# EAGLE design isofet (EAGLE 4.13)
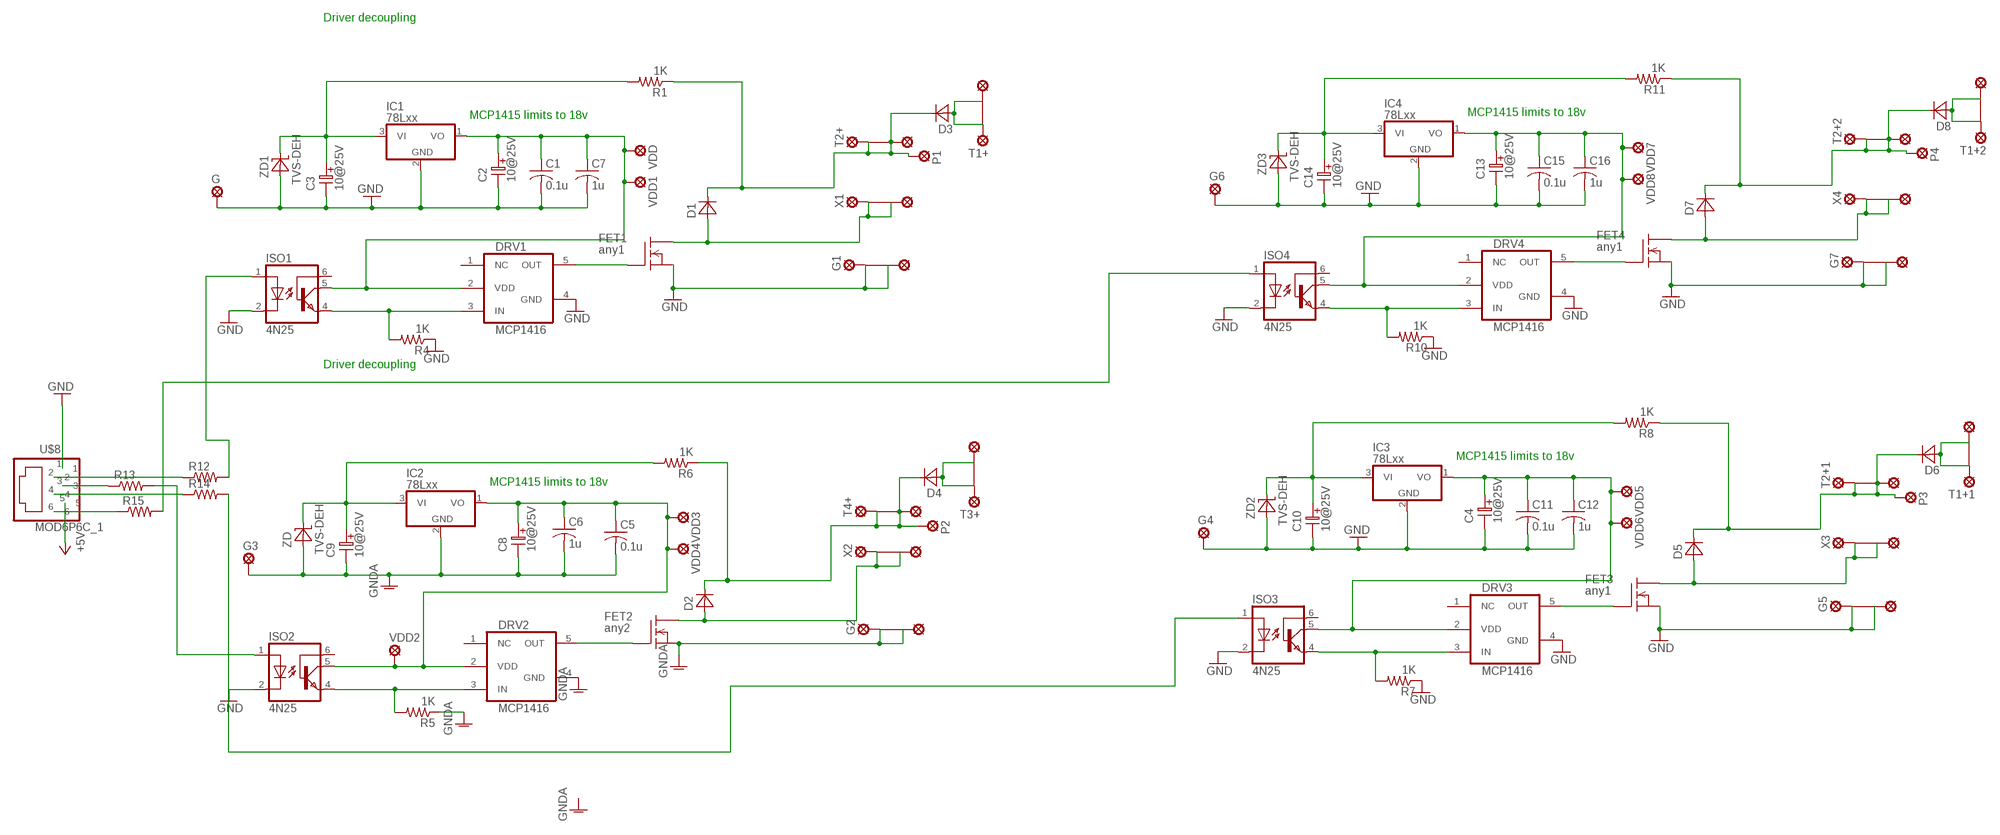
[diagram p0: schematic, sheet 1]

## Parts
C1  0.1u  C-USC0603  [C0603]
C2  10@25V  ELC-2,5L  [ES-2,5L]
C3  10@25V  ELC-2,5L  [ES-2,5L]
C4  10@25V  ELC-2,5L  [ES-2,5L]
C5  0.1u  C-USC0603  [C0603]
C6  1u  C-USC0603  [C0603]
C7  1u  C-USC0603  [C0603]
C8  10@25V  ELC-2,5L  [ES-2,5L]
C9  10@25V  ELC-2,5L  [ES-2,5L]
C10  10@25V  ELC-2,5L  [ES-2,5L]
C11  0.1u  C-USC0603  [C0603]
C12  1u  C-USC0603  [C0603]
C13  10@25V  ELC-2,5L  [ES-2,5L]
C14  10@25V  ELC-2,5L  [ES-2,5L]
C15  0.1u  C-USC0603  [C0603]
C16  1u  C-USC0603  [C0603]
D1  DIODE-10  [D-10]
D2  DIODE-10  [D-10]
D3  DIODE-10  [D-10]
D4  DIODE-10  [D-10]
D5  DIODE-10  [D-10]
D6  DIODE-10  [D-10]
D7  DIODE-10  [D-10]
D8  DIODE-10  [D-10]
DRV1  MCP1416  [SOT23-5]
DRV2  MCP1416  [SOT23-5]
DRV3  MCP1416  [SOT23-5]
DRV4  MCP1416  [SOT23-5]
FET1  any1  FET220V  [TO220V]
FET2  any2  FET220V  [TO220V]
FET3  any1  FET220V  [TO220V]
FET4  any1  FET220V  [TO220V]
G  SOLDPAD028  [SOLPAD028]
G1  SOLPADQUICKDISC  [SOLPADQUICKDISC]
G2  SOLPADQUICKDISC  [SOLPADQUICKDISC]
G3  SOLDPAD028  [SOLPAD028]
G4  SOLDPAD028  [SOLPAD028]
G5  SOLPADQUICKDISC  [SOLPADQUICKDISC]
G6  SOLDPAD028  [SOLPAD028]
G7  SOLPADQUICKDISC  [SOLPADQUICKDISC]
IC1  78Lxx  7805L  [TO92]
IC2  78Lxx  7805L  [TO92]
IC3  78Lxx  7805L  [TO92]
IC4  78Lxx  7805L  [TO92]
ISO1  4N25  4N35  [DIL06]
ISO2  4N25  4N35  [DIL06]
ISO3  4N25  4N35  [DIL06]
ISO4  4N25  4N35  [DIL06]
P1  SOLPAD035  [SOLDPAD035]
P2  SOLPAD035  [SOLDPAD035]
P3  SOLPAD035  [SOLDPAD035]
P4  SOLPAD035  [SOLDPAD035]
R1  1K  R-US_R0603  [R0603]
R4  1K  R-US_R0603  [R0603]
R5  1K  R-US_R0603  [R0603]
R6  1K  R-US_R0603  [R0603]
R7  1K  R-US_R0603  [R0603]
R8  1K  R-US_R0603  [R0603]
R10  1K  R-US_R0603  [R0603]
R11  1K  R-US_R0603  [R0603]
R12  R-US_0207/2V  [0207/2V]
R13  R-US_0207/2V  [0207/2V]
R14  R-US_0207/2V  [0207/2V]
R15  R-US_0207/2V  [0207/2V]
T1+  SOLPADQUICKDISC  [SOLPADQUICKDISC]
T1+1  SOLPADQUICKDISC  [SOLPADQUICKDISC]
T1+2  SOLPADQUICKDISC  [SOLPADQUICKDISC]
T2+  SOLPADQUICKDISC  [SOLPADQUICKDISC]
T2+1  SOLPADQUICKDISC  [SOLPADQUICKDISC]
T2+2  SOLPADQUICKDISC  [SOLPADQUICKDISC]
T3+  SOLPADQUICKDISC  [SOLPADQUICKDISC]
T4+  SOLPADQUICKDISC  [SOLPADQUICKDISC]
U$8  MOD6P6C_1  [MOD6P6C_1]
VDD  SOLDPAD028  [SOLPAD028]
VDD1  SOLPAD035  [SOLDPAD035]
VDD2  SOLPAD035  [SOLDPAD035]
VDD3  SOLDPAD028  [SOLPAD028]
VDD4  SOLPAD035  [SOLDPAD035]
VDD5  SOLDPAD028  [SOLPAD028]
VDD6  SOLPAD035  [SOLDPAD035]
VDD7  SOLDPAD028  [SOLPAD028]
VDD8  SOLPAD035  [SOLDPAD035]
X1  SOLPADQUICKDISC  [SOLPADQUICKDISC]
X2  SOLPADQUICKDISC  [SOLPADQUICKDISC]
X3  SOLPADQUICKDISC  [SOLPADQUICKDISC]
X4  SOLPADQUICKDISC  [SOLPADQUICKDISC]
ZD  TVS-DEH  [TVS-DEH]
ZD1  TVS-DEH  [TVS-DEH]
ZD2  TVS-DEH  [TVS-DEH]
ZD3  TVS-DEH  [TVS-DEH]

## Nets
+5V: U$8.5
CAN_PROTECTED+: C3.1 IC1.3(VI) R1.2 ZD1.C
CAN_PROTECTED+1: C9.1 IC2.3(VI) R6.2 ZD.C
CAN_PROTECTED+2: C10.1 IC3.3(VI) R8.2 ZD2.C
CAN_PROTECTED+3: C14.1 IC4.3(VI) R11.2 ZD3.C
FET2_PLUS: D2.2(K) D4.2(K) P2.MP R6.1 T4+.P$1(MP) T4+.P$2(MP1)
FET_DRIVE_1: DRV1.5(OUT) FET1.1(G)
FET_DRIVE_2: DRV2.5(OUT) FET2.1(G)
FET_DRIVE_3: DRV3.5(OUT) FET3.1(G)
FET_DRIVE_4: DRV4.5(OUT) FET4.1(G)
FET_DRVR1_IN: DRV1.3(IN) ISO1.4(EMI) R4.2
FET_DRVR1_IN1: DRV3.3(IN) ISO3.4(EMI) R7.2
FET_DRVR1_IN2: DRV4.3(IN) ISO4.4(EMI) R10.2
FET_DRVR2_IN: DRV2.3(IN) ISO2.4(EMI) R5.2
GND: C1.2 C2.2 C3.2 C4.2 C7.2 C10.2 C11.2 C12.2 C13.2 C14.2 C15.2 C16.2 DRV1.4(GND) DRV3.4(GND) DRV4.4(GND) FET1.3(S) FET3.3(S) FET4.3(S) G1.P$1(MP) G1.P$2(MP1) G4.MP G5.P$1(MP) G5.P$2(MP1) G6.MP G7.P$1(MP) G7.P$2(MP1) G.MP IC1.2(GND) IC3.2(GND) IC4.2(GND) ISO1.2(C) ISO2.2(C) ISO3.2(C) ISO4.2(C) R4.1 R7.1 R10.1 U$8.1 ZD1.A ZD2.A ZD3.A
GNDA: C5.2 C6.2 C8.2 C9.2 DRV2.4(GND) FET2.3(S) G2.P$1(MP) G2.P$2(MP1) G3.MP IC2.2(GND) R5.1 ZD.A
LOAD1_SWITCHED: D1.1(A) FET1.2(D) X1.P$1(MP) X1.P$2(MP1)
LOAD1_SWITCHED1: D5.1(A) FET3.2(D) X3.P$1(MP) X3.P$2(MP1)
LOAD1_SWITCHED2: D7.1(A) FET4.2(D) X4.P$1(MP) X4.P$2(MP1)
LOAD2_SWITCHED: D2.1(A) FET2.2(D) X2.P$1(MP) X2.P$2(MP1)
N$1: D4.1(A) T3+.P$1(MP) T3+.P$2(MP1)
N$2: D3.1(A) T1+.P$1(MP) T1+.P$2(MP1)
N$3: C1.1 C2.1 C7.1 DRV1.2(VDD) IC1.1(VO) ISO1.5(COL) VDD1.MP VDD.MP
N$4: D6.1(A) T1+1.P$1(MP) T1+1.P$2(MP1)
N$5: C4.1 C11.1 C12.1 DRV3.2(VDD) IC3.1(VO) ISO3.5(COL) VDD5.MP VDD6.MP
N$6: D8.1(A) T1+2.P$1(MP) T1+2.P$2(MP1)
N$7: C13.1 C15.1 C16.1 DRV4.2(VDD) IC4.1(VO) ISO4.5(COL) VDD7.MP VDD8.MP
N$8: ISO1.1(A) R12.2
N$9: ISO2.1(A) R13.2
N$10: ISO3.1(A) R14.2
N$11: ISO4.1(A) R15.2
PA15_BUFF: R12.1 U$8.2
PC6_BUFF: R15.1 U$8.6
PC9_BUFF: R14.1 U$8.4
PC12_BUFF: R13.1 U$8.3
POWER_PLUS: D1.2(K) D3.2(K) P1.MP R1.1 T2+.P$1(MP) T2+.P$2(MP1)
POWER_PLUS1: D5.2(K) D6.2(K) P3.MP R8.1 T2+1.P$1(MP) T2+1.P$2(MP1)
POWER_PLUS2: D7.2(K) D8.2(K) P4.MP R11.1 T2+2.P$1(MP) T2+2.P$2(MP1)
VDD2: C5.1 C6.1 C8.1 DRV2.2(VDD) IC2.1(VO) ISO2.5(COL) VDD2.MP VDD3.MP VDD4.MP
Unconnected: DRV1.1(NC) DRV2.1(NC) DRV3.1(NC) DRV4.1(NC) ISO1.6(BAS) ISO2.6(BAS) ISO3.6(BAS) ISO4.6(BAS)

## Notes on the sheet
- Driver decoupling
- MCP1415 limits to 18v | MCP1415 limits to 18v
- Driver decoupling
- MCP1415 limits to 18v
- MCP1415 limits to 18v

## Library data of the parts
C1 C5-C7 C11 C12 C15 C16 = rcl:C-US: CAPACITOR, American symbol
C2-C4 C8-C10 C13 C14 = DEH:ELC-2,5L
D1-D8 = DEH:DIODE-10
DRV1-DRV4 = DEH:MCP1416
FET1-FET4 = transistor-fet:FET220V
G G3 G4 G6 VDD VDD3 VDD5 VDD7 = solpad:SOLDPAD028
G1 G2 G5 G7 T1+ T1+1 T1+2 T2+ T2+1 T2+2 T3+ T4+ X1-X4 = solpad:SOLPADQUICKDISC
IC1-IC4 = linear:78*: Positive VOLTAGE REGULATOR
ISO1-ISO4 = optocoupler-2:4N35: MOTOROLA OPTO COUPLER
P1-P4 VDD1 VDD2 VDD4 VDD6 VDD8 = solpad:SOLPAD035
R1 R4-R8 R10-R15 = rcl:R-US_: RESISTOR, American symbol
U$8 = DEH:MOD6P6C_1
ZD ZD1-ZD3 = diode-1:TVS-DEH

## Board
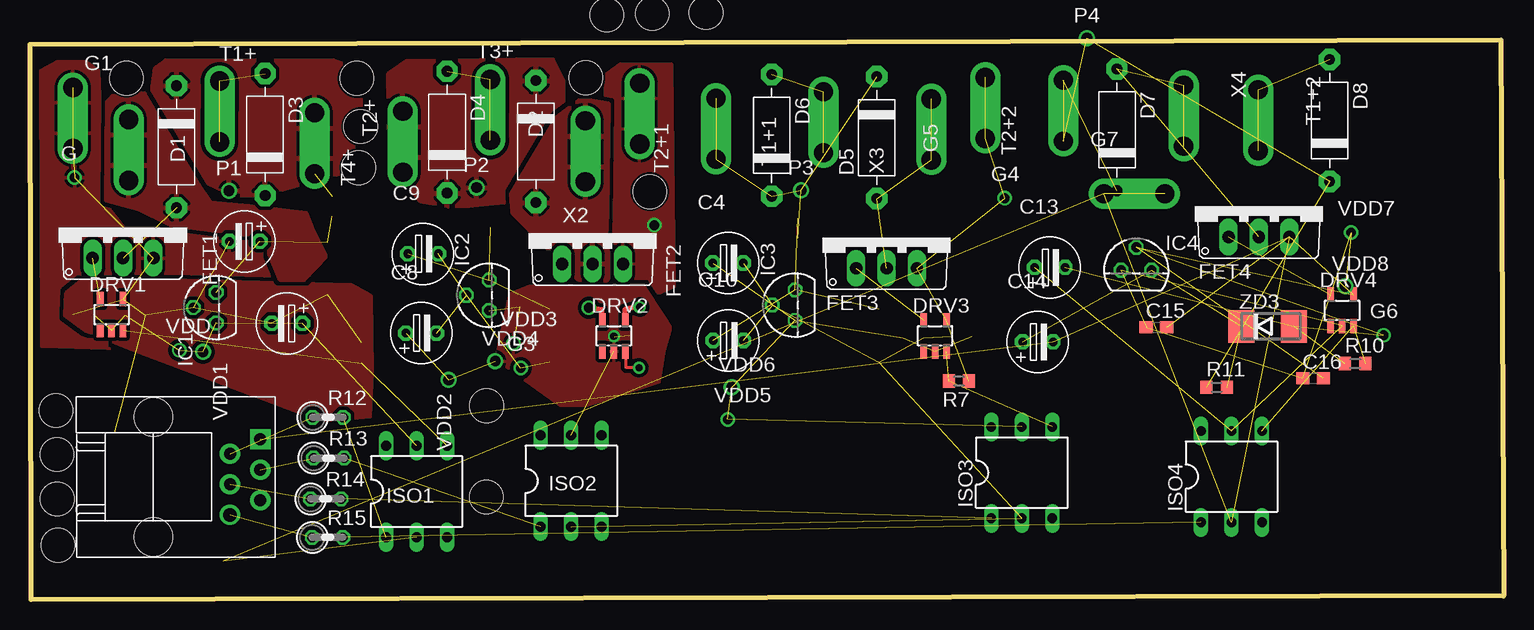
[diagram p1: board, top side]
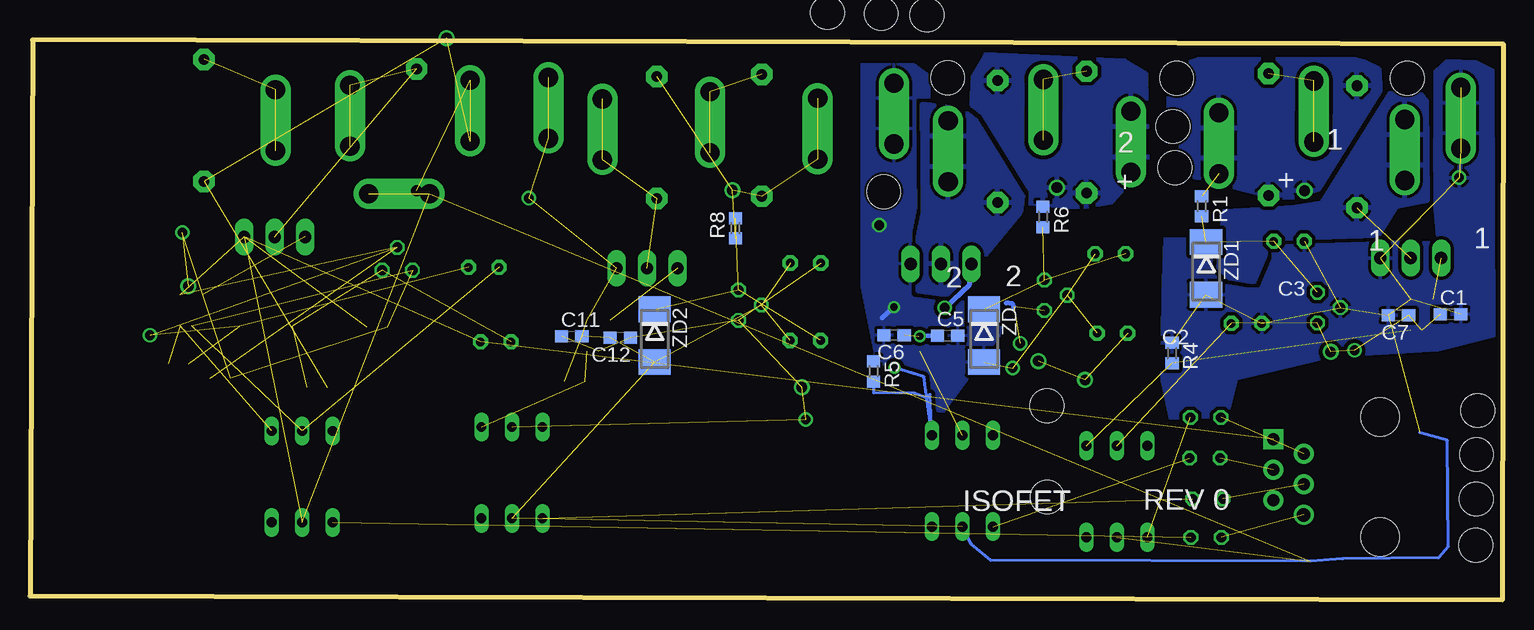
[diagram p2: board, bottom side, seen from below]

Size 122.84 x 46.64 mm. Coordinates in mm from the lower left corner, seen from the top.
Outline: 0.09,0 0,46.26 122.62,46.64 122.84,0.32 0.09,0
Copper layers (1*16): Top 0.035mm / dielectric 1.5mm / Bottom 0.035mm
Design rules "default": minimum track width 8mil, minimum drill 0.6mm, track to track 12mil, track to pad 10mil, pad to pad 10mil, via to via 8mil, smd to smd 0mil, copper to edge 8mil, drill to drill 8mil, minimum pad ring 8mil, minimum via ring 8mil, stop-mask expansion 4mil, vias tented up to drill 0mil, thermal gap 10mil
Holes 2.8 mm at 27.57,39.43 2.33,4.54 27.4,35.99 2.16,15.76 48.08,48.74 8.04,43.45 46.34,43.48 51.67,34 27.25,43.44 2.25,12.1 2.27,8.38 56.36,48.92 51.88,48.85 38.07,16.16 38.05,8.55

### Footprints (pad centres in the part's own frame; a part is rotated, then mirrored left to right if it is on the bottom)
C0603 = smd 1.1 x 1: 1 -0.85,0; 2 0.85,0
ES-2,5L = drill 0.711 pad 1.27 octagon: 1 0,0; 2 2.54,0
D-10 = drill 0.889 pad 1.778 octagon: 1 -5.08,0; 2 5.08,0
SOT23-5 = smd 0.55 x 1.2: 1 -0.95,-1.3; 2 0,-1.3; 3 0.95,-1.3; 4 0.95,1.3; 5 -0.95,1.3
TO220V = drill 1.016 long: 1 -2.54,-2.54; 2 0,-2.54; 3 2.54,-2.54
SOLPAD028 = drill 0.8 pad 1.1 round: MP 0,0
SOLPADQUICKDISC = drill 1.6 pad 2.54 offset: P$1 2.54,0; P$2 -2.54,0
TO92 = drill 0.813 octagon: 1 -1.27,0; 2 0,1.905; 3 1.27,0
DIL06 = drill 0.813 long: 1 -2.54,-3.81; 2 0,-3.81; 3 2.54,-3.81; 4 2.54,3.81; 5 0,3.81; 6 -2.54,3.81
SOLDPAD035 = drill 0.889 pad 1.27 round: MP 0,0
R0603 = smd 1 x 1.1: 1 -0.85,0; 2 0.85,0
0207/2V = drill 0.813 octagon: 1 -1.27,0; 2 1.27,0
MOD6P6C_1 = drill 1 pad 1.676 square: 1 -3.175,8.898 | drill 1 pad 1.676 round: 2 -1.951,6.358; 3 -0.627,8.898; 4 0.597,6.358; 5 1.921,8.898 | drill 1.1 pad 1.676 round: 6 3.145,6.358 | hole 3.2: -5.029,-0.01; 4.999,-0.01
TVS-DEH = smd 2.16 x 2.7: A 2.19,-0.05; C -2.2,-0.05

### Placement (x,y rotation side)
C1  4.42,23.79 0 bottom
C2  22.7,23.02 180 top
C3  19.16,29.85 180 top
C4  56.92,28.05 0 top
C5  46.35,22 0 bottom
C6  50.81,22.04 180 bottom
C7  8.77,23.68 180 bottom
C8  31.34,22.2 0 top
C9  31.5,28.82 0 top
C10  56.94,21.6 0 top
C11  77.69,21.95 0 bottom
C12  73.64,21.83 180 bottom
C13  83.74,27.69 0 top
C14  82.74,21.48 0 top
C15  93.9,22.69 0 top
C16  106.96,18.44 0 top
D1  12.22,37.74 90 top
D2  42.18,38.17 90 top
D3  19.6,38.76 270 top
D4  34.77,38.95 270 top
D5  70.59,38.5 90 top
D6  61.83,38.69 270 top
D7  90.61,39.15 270 top
D8  108.34,39.93 270 top
DRV1  6.8,23.75 0 top
DRV2  48.67,21.98 0 top
DRV3  75.45,21.98 0 top
DRV4  109.38,24.11 0 top
FET1  7.75,31 0 top
FET2  46.89,30.51 0 top
FET3  71.41,30.16 0 top
FET4  102.45,32.76 0 top
G  3.71,35.16 0 top
G1  3.58,40.13 270 top
G2  50.83,40.5 270 top
G3  40.91,19.29 0 top
G4  81.25,33.45 0 top
G5  79.63,40.97 90 top
G6  112.83,22.03 0 top
G7  92.06,33.81 0 top
IC1  15.52,24.33 90 top
IC2  38.28,25.36 90 top
IC3  63.78,24.54 90 top
IC4  92.22,27.45 0 top
ISO1  32.23,9.01 0 top
ISO2  45.11,9.89 0 top
ISO3  82.67,10.58 0 top
ISO4  100.16,10.25 0 top
P1  16.59,34.07 0 top
P2  37.23,34.34 0 top
P3  64.29,34.11 0 top
P4  88.11,46.8 0 top
R1  25.17,32.78 270 bottom
R4  27.64,20.54 270 bottom
R5  52.52,19.02 270 bottom
R6  38.4,31.9 270 bottom
R7  77.44,18.21 180 top
R8  64.03,30.95 90 bottom
R10  110.47,19.67 0 top
R11  98.92,17.69 0 top
R12  24.84,15.18 0 top
R13  24.91,11.79 0 top
R14  24.66,8.39 0 top
R15  24.8,5.18 0 top
T1+  15.81,40.68 270 top
T1+1  66.15,39.79 90 top
T1+2  102.38,39.95 270 top
T2+  23.73,38.03 270 top
T2+1  57.18,39.24 90 top
T2+2  86.15,40.73 90 top
T3+  38.37,40.81 90 top
T4+  31.08,38.15 90 top
U$8  10.31,10.2 270 top
VDD  12.44,20.78 0 top
VDD1  14.42,20.64 0 top
VDD2  34.89,18.31 0 top
VDD3  40.31,21.36 0 top
VDD4  38.78,19.87 0 top
VDD5  58.16,15.02 0 top
VDD6  58.5,17.7 0 top
VDD7  110.14,30.59 0 top
VDD8  109.64,26.11 0 top
X1  8.23,37.47 90 top
X2  46.3,37.36 90 top
X3  75.13,39.18 90 top
X4  96.17,40.33 270 top
ZD  43.27,21.99 270 bottom
ZD1  24.76,27.6 270 bottom
ZD2  70.73,21.99 270 bottom
ZD3  103.17,22.81 0 top

### Tracks (layer width: path | path; a pad name or v marks a point on that pad's centre or on a via)
+5V
  pour Top (rank 3): 24.32,14.88 8.21,20.92 4.63,22.37 2.88,23.67 2.98,25.57 4.29,26.62 11.53,26.68 26.79,26.27 28.42,25.35 28.54,18.99 28.37,15.2
CAN_PROTECTED+  (3 unrouted)
CAN_PROTECTED+1  (3 unrouted)
CAN_PROTECTED+2  (3 unrouted)
CAN_PROTECTED+3  (3 unrouted)
FET2_PLUS
  pour Top (rank 2): 43.54,45.01 44.41,43.26 44.38,40.52 39.53,33.13 36.54,32.81 34.87,32.81 32.58,33.2 30.02,36.54 29.91,43.81 31.41,44.85
  pour Bottom (rank 2): 44.35,41.24 43.47,40.46 39.59,33.09 36.31,32.78 34.92,32.8 32.66,33.16 29.69,36.48 29.82,43.83 31.55,44.87 43.17,45.41 44.23,43.58
FET_DRIVE_1  (1 unrouted)
FET_DRIVE_2  (via drill 0.8)
  Top 0.406: DRV2.5 47.67,24.17 v46.59,24.32
  Bottom 0.406: FET2.1 44.37,27.95 44.5,26.3 v46.59,24.32
FET_DRIVE_3  (1 unrouted)
FET_DRIVE_4  (1 unrouted)
FET_DRVR1_IN  (2 unrouted)
FET_DRVR1_IN1  (2 unrouted)
FET_DRVR1_IN2  (2 unrouted)
FET_DRVR2_IN  (via drill 0.6 pad 0.25)
  Top 0.254: v50.76,19.32 49.68,19.34 49.68,20.6 DRV2.3
  Bottom 0.254: R5.2 52.5,17.23 49.11,17.21 48.06,16.79 47.81,17.1 ISO2.4 48.3,18.57 v50.76,19.32
GND  (40 unrouted)
  Bottom 0.254: ISO2.2 44.35,4.63 42.74,3.26 16.11,3.2 13.44,3.39 5.41,3.48 4.6,4.42 4.68,13.27 7,13.91
  pour Top (rank 4): 6.16,33.16 7.87,30.98 28.05,30.83 28.35,20.97 28.81,15.06 24.62,15.03 14.9,20.91 6.44,20.94 0.96,21.1 0.88,44.08 2.25,44.83 4.7,44.83 5.71,44.06
  pour Bottom (rank 4): 5.72,32.95 5.46,29.74 28.22,30.09 28.4,25.35 28.48,18.45 27.79,15.11 23.07,15.28 22.29,18.4 14.35,20.26 5.46,20.82 0.83,22 0.9,44.1 2.33,44.83 4.74,44.92 5.7,44.03
GNDA  (via drill 0.6, 0.8)  (4 unrouted)
  Top 0.406: DRV2.4 49.59,24.16 50.05,24.32 v50.83,24.38
  Bottom 0.406: v50.83,24.38 51.81,23.45
  other vias: 52.05,31.2
  pour Top (rank 4): 53.52,44.62 49.18,44.64 47.99,43.76 47.71,31.62 47.89,29.17 50.15,24.52 53.73,26.13
  pour Bottom (rank 4): 49.19,44.63 47.94,43.69 47.71,31.97 41.78,24.68 42.06,21.93 46.69,15.65 51.49,16.16 53.48,26.2 53.49,44.62
LOAD1_SWITCHED  (1 unrouted)
  pour Top (rank 2): 11.69,31.3 19.37,30.3 20.84,26.71 22.82,26.67 24.64,28.59 23.51,30.85 23.01,32.16 18.23,32.74 15.06,33.03 14.03,34.57 9.54,42.12 7.15,42.19 6.42,41.44 6.35,33.34 8.98,32.63
  pour Bottom (rank 2): 6.37,33.25 8.94,32.74 10.45,30.34 18.23,30.08 19.52,29.59 20.86,26.46 22.8,26.76 23.74,27.7 23.44,31.13 23.25,32.37 17.53,32.69 15.15,33.09 9.5,42.16 7.55,42.99 6.43,41.56
LOAD1_SWITCHED1  (3 unrouted)
LOAD1_SWITCHED2  (3 unrouted)
LOAD2_SWITCHED
  pour Top: 45.74,41.55 43.89,40.15 40.1,33.77 40.23,32.27 45.79,26.67 48.11,26.66 48.38,27.12 48.04,30.22 48.11,32.19 48.21,41.28 46.55,41.57
  pour Bottom: 45.18,40.92 44.02,39.98 40.11,33.66 40.29,32.3 46.02,25.34 48.81,25.71 48.79,30.22 48.36,32.26 48.43,41.31
N$1  (2 unrouted)
N$2  (2 unrouted)
N$3  (7 unrouted)
N$4  (2 unrouted)
N$5  (7 unrouted)
N$6  (2 unrouted)
N$7  (7 unrouted)
N$8  (1 unrouted)
N$9  (1 unrouted)
N$10  (1 unrouted)
N$11  (1 unrouted)
PA15_BUFF  (1 unrouted)
PC6_BUFF  (1 unrouted)
PC9_BUFF  (1 unrouted)
PC12_BUFF  (1 unrouted)
POWER_PLUS  (1 unrouted)
  pour Top (rank 3): 27.53,35.97 19.29,33.71 17.03,33.7 14.91,34.7 10.21,42.43 10.49,44.3 11.35,44.91 25.23,44.92 27.5,44.13
  pour Bottom (rank 3): 11.61,44.83 10.41,44.22 10.29,42.25 15.28,34.24 17.65,33.47 19.18,33.55 27.19,35.57 27.95,36.65 27.87,44.26 25.42,45.03 12.54,45.07
POWER_PLUS1  (5 unrouted)
POWER_PLUS2  (5 unrouted)
VDD2  (via drill 0.6)  (6 unrouted)
  Top 0.406: v48.67,21.95 48.72,21.92
  Bottom 0.406: C5.1 v48.67,21.95 | 41.48,24.73 40.94,24.64 40.82,24.4
  pour Top (rank 2): 51.11,26.22 41.66,26.12 39.99,25.43 38.8,20.02 44.16,16.21 46.41,16.21 52.46,18.14 52.89,20.78 53.42,22.65

### Text on the board
bNames: 1 | 2 | + | + | 1 | 1 | 2 | 2 | REV 0 | ISOFET